# Altium schematic sheet BOARD2.SchDoc
size A4
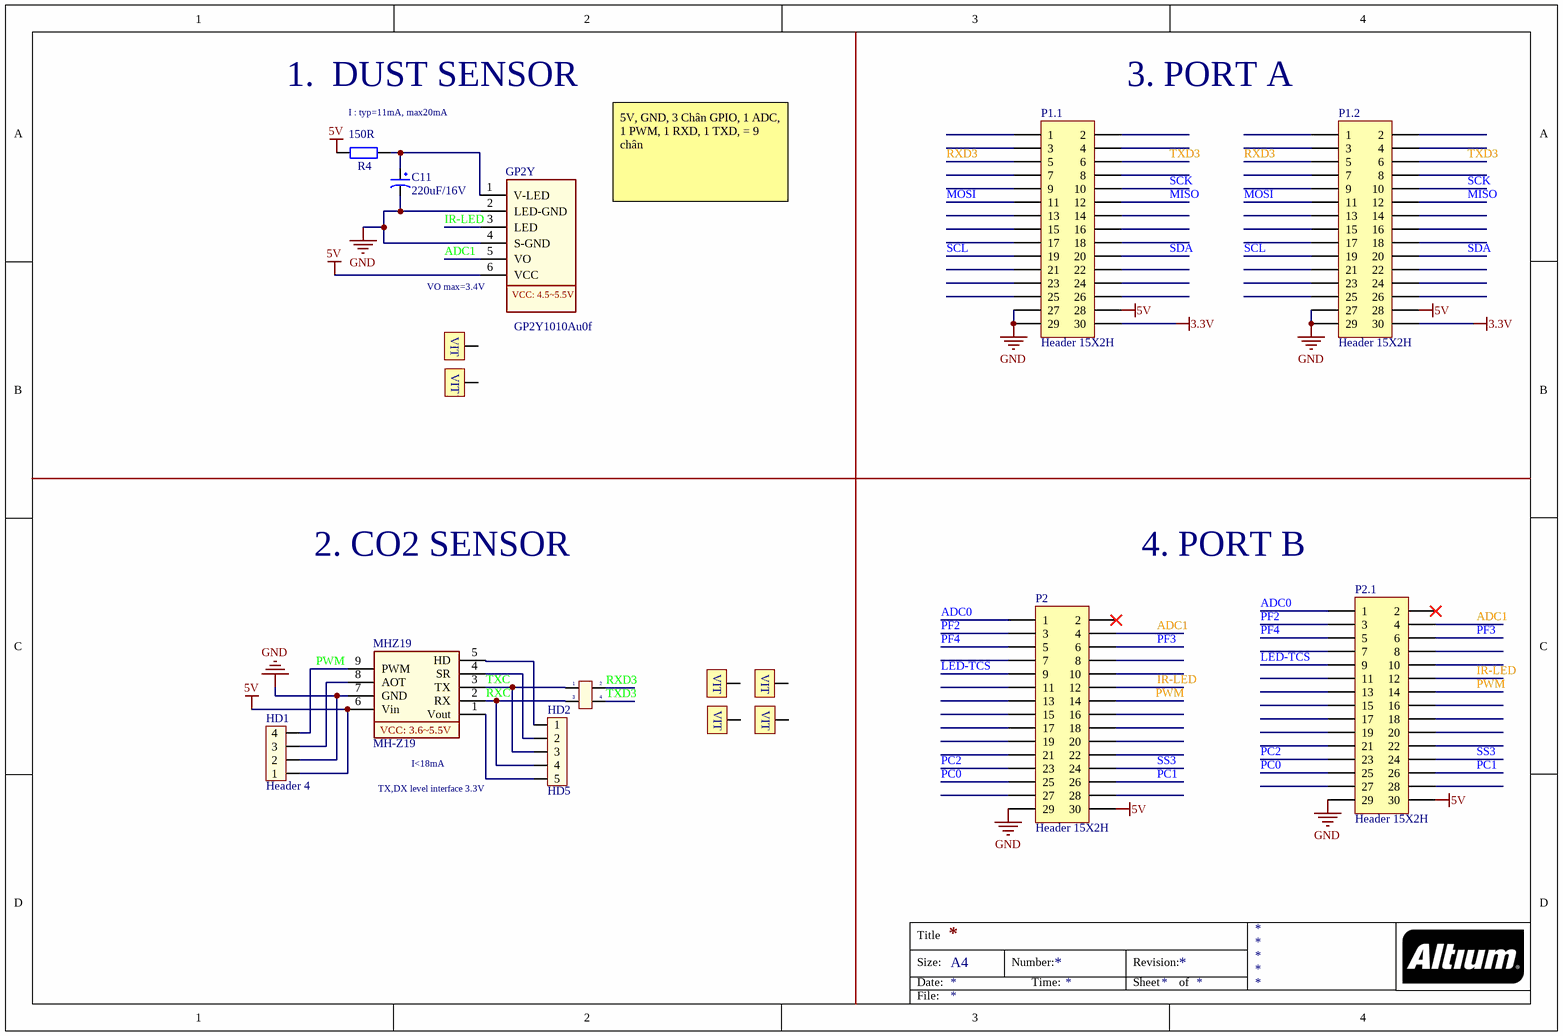
[diagram p0: BOARD2.SchDoc]

## Parts
C11  220uF/16V  [CAPMP7343X430N]
GP2Y  GP2Y1010Au0f  [GP2Y1010AU0F]
HD1  Header 4  [Header_4]
HD2  HD5  [Header_5]
J?  Jumper 2x2  [HDR2X2]  (value not drawn)
MHZ19  MH-Z19  [MH-Z19]
P1.1  Header 15X2H  [HED15X2H]
P1.2  Header 15X2H  [HED15X2H]
P2  Header 15X2H  [HED15X2H]
P2.1  Header 15X2H  [HED15X2H]
R4  150R  [Res 0805 SMD]
VIT2  1  [Screw 3 small]  (value not drawn)
VIT3  1  [Screw 3 small]  (value not drawn)
VIT5  1  [Screw 3 small]  (value not drawn)
VIT6  1  [Screw 3 small]  (value not drawn)
VIT7  1  [Screw 3 small]  (value not drawn)
VIT8  1  [Screw 3 small]  (value not drawn)

## Nets
3.3V: P1.1.30 P1.2.30
5V: GP2Y.6(VCC) HD1.1 MHZ19.6(Vin) P1.1.28 P1.2.28 P2.30 P2.1.30 R4.1
GND: C11.2 GP2Y.2(LED-GND) GP2Y.4(S-GND) HD1.2 MHZ19.7(GND) P1.1.27 P1.1.29 P1.2.27 P1.2.29 P2.29 P2.1.29
ADC0: P2.1 P2.1.1
ADC1: GP2Y.5(VO) P2.4 P2.1.4
IR-LED: GP2Y.3(LED) P2.12 P2.1.12
LED-TCS: P2.9 P2.1.9
MISO: P1.1.12 P1.2.12
MOSI: P1.1.11 P1.2.11
PC0: P2.25 P2.1.25
PC1: P2.26 P2.1.26
PC2: P2.23 P2.1.23
PF2: P2.3 P2.1.3
PF3: P2.6 P2.1.6
PF4: P2.5 P2.1.5
PWM: HD1.4 MHZ19.9(PWM) P2.14 P2.1.14
RXC: HD2.4 J?.3 MHZ19.2(RX)
RXD3: J?.2 P1.1.5 P1.2.5
SCK: P1.1.10 P1.2.10
SCL: P1.1.19 P1.2.19
SDA: P1.1.20 P1.2.20
SS3: P2.24 P2.1.24
TXC: HD2.3 J?.1 MHZ19.3(TX)
TXD3: J?.4 P1.1.6 P1.2.6
NetC11_1: C11.1 GP2Y.1(V-LED) R4.2
NetHD1_3: HD1.3 MHZ19.8(AOT)
NetHD2_1: HD2.1 MHZ19.5(HD)
NetHD2_2: HD2.2 MHZ19.4(SR)
NetHD2_5: HD2.5 MHZ19.1(Vout)

Not connected (* = marked no-connect by the designer): P1.1 1 2 3 4 7 8 9 13 14 15 16 17 18 21 22 23 24 25 26; P1.2 1 2 3 4 7 8 9 13 14 15 16 17 18 21 22 23 24 25 26; P2 2* 7 8 10 11 13 15 16 17 18 19 20 21 22 27 28; P2.1 2* 7 8 10 11 13 15 16 17 18 19 20 21 22 27 28; VIT2 VIT1(1); VIT3 VIT1(1); VIT5 VIT1(1); VIT6 VIT1(1); VIT7 VIT1(1); VIT8 VIT1(1)

## Notes on the sheet
- 1.  DUST SENSOR
- (near R4) I : typ=11mA, max20mA
- 3. PORT A
- 5V, GND, 3 Chân GPIO, 1 ADC, 1 PWM, 1 RXD, 1 TXD, = 9 chân
- (near GP2Y) VO max=3.4V
- 2. CO2 SENSOR
- 4. PORT B
- (near MHZ19) I<18mA
- (near HD2) TX,DX level interface 3.3V
- Title
- Size:
- Date:
- A4
- Number:
- Time:
- Revision:
- Sheet
- of
- File:
- (in symbol GP2Y1010Au0f) VCC: 4.5~5.5V
- (in symbol MH-Z19) VCC: 3.6~5.5V

## Library data of the parts
C11 = CP4: Cap 1000uF/16V - 220uF/50V; Description 5: 4,7uF>10uF/250V_3,3uF>10uF/400V - 2,2uF>4,7uF/450V; Description 1: 2200uF-3300uF/6,3V - 1000uF-2200uF/10V; Description 2: 1000uF/16V - 470uF => 1000uF/25V - 100uF/100V; Description 3: 330uF>470uF/35V_220uF>470uF/50V_10uF>22uF/250V; Description 4: 220uF => 330uF/63V - 10uF =>33uF/160 - 200V; Value: 1000uF/16V
GP2Y = GP2Y1010Au0f: dust sensor 2.5
HD1 = Header4: Value: Header 4
HD2 = Header5: Header 5; Creat by: VanDungEvn@Gmail.com
J? = JP2x2: Value: JP 2x2
MHZ19 = MH-Z19: Co2 sensor
P1.1 P1.2 P2 P2.1 = Header 15X2H: Header, 15-Pin, Dual row, Right Angle; LatestRevisionDate: 17-Jul-2002; LatestRevisionNote: Re-released for DXP Platform.; Publisher: Altium Limited
R4 = RM: Resistor SMD; Value: 150R
VIT2 VIT3 VIT5-VIT8 = VIT: Oc Vit